# EAGLE design board (EAGLE 6.5.0)
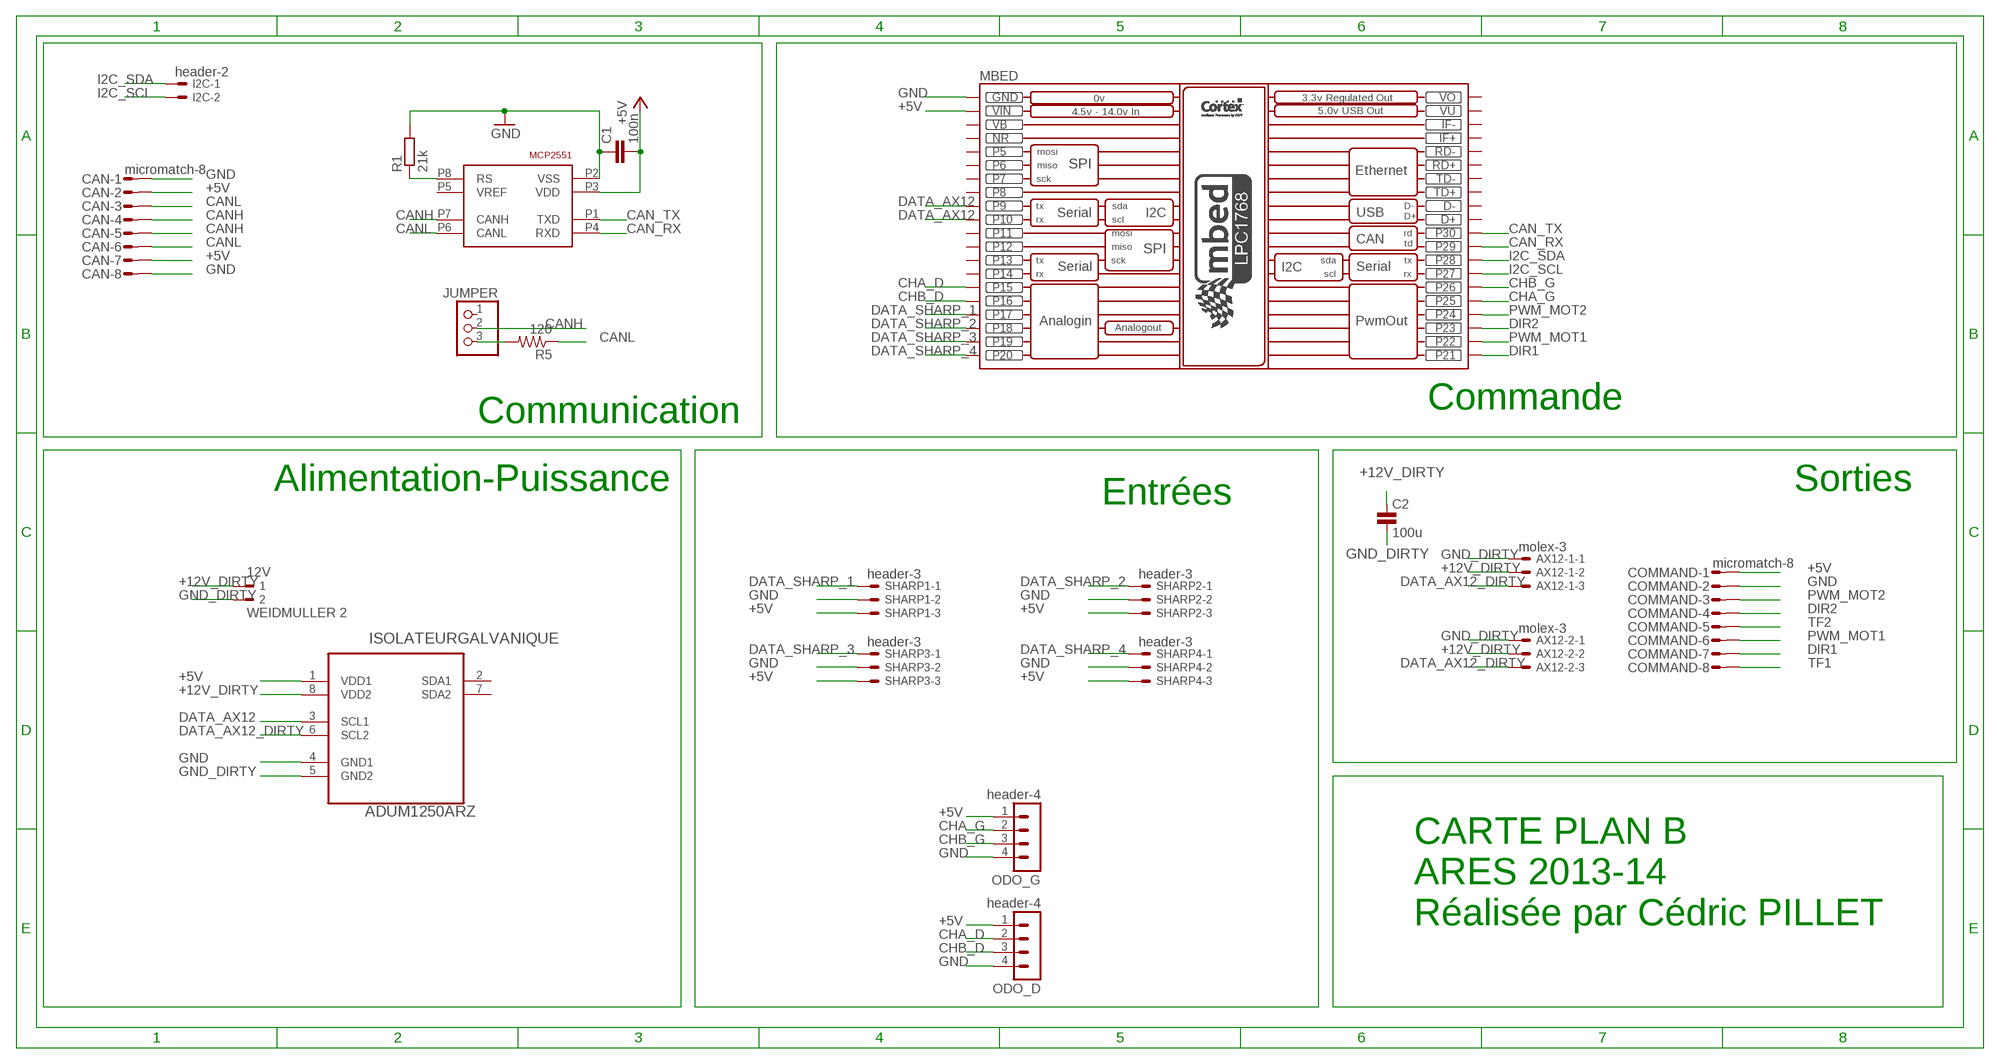
[diagram p0: schematic, sheet 1]

## Parts
12V  WEIDMULLER 2  90G-2  [90G-2]
AX12-1  molex-3  22-23-2031  [22-23-2031]
AX12-2  molex-3  22-23-2031  [22-23-2031]
C1  100n  C-EUC0805  [C0805]
C2  100u  C0805  [0805]
CAN  micromatch-8  MICROMATCH-8  [MICROMATCH-8]
COMMAND  micromatch-8  MICROMATCH-8  [MICROMATCH-8]
I2C  header-2  22-23-2021  [22-23-2021]
ISOLATEURGALVANIQUE  ADUM1250ARZ  [SOIC127P600X175-8N]
JUMPER  PINHD-1X3  [1X03]
MBED  MBED_NXP_LPC1768  [MBED-KIT]
ODO_D  header-4  MA04-1  [MA04-1]
ODO_G  header-4  MA04-1  [MA04-1]
R1  21k  R-EU_R0805  [R0805]
R5  120  R-US_M0805  [M0805]
SHARP1  header-3  22-23-2031  [22-23-2031]
SHARP2  header-3  22-23-2031  [22-23-2031]
SHARP3  header-3  22-23-2031  [22-23-2031]
SHARP4  header-3  22-23-2031  [22-23-2031]
TRANSCEIVER  MCP2551  [SOIC_8]

## Nets
+5V: C1.2 CAN.2 CAN.7 COMMAND.1 ISOLATEURGALVANIQUE.1(VDD1) MBED.VIN ODO_D.1 ODO_G.1 SHARP1.3 SHARP2.3 SHARP3.3 SHARP4.3 TRANSCEIVER.P3(VDD)
+12V_DIRTY: 12V.1 AX12-1.2 AX12-2.2 C2.1 ISOLATEURGALVANIQUE.8(VDD2)
CAN_RX: MBED.P$29(P29) TRANSCEIVER.P4(RXD)
CAN_TX: MBED.P$30(P30) TRANSCEIVER.P1(TXD)
CANH: CAN.4 CAN.5 JUMPER.2 TRANSCEIVER.P7(CANH)
CANL: CAN.3 CAN.6 R5.1 TRANSCEIVER.P6(CANL)
CHA_D: MBED.P$15(P15) ODO_D.2
CHA_G: MBED.P$25(P25) ODO_G.2
CHB_D: MBED.P$16(P16) ODO_D.3
CHB_G: MBED.P$26(P26) ODO_G.3
DATA_AX12: ISOLATEURGALVANIQUE.3(SCL1) MBED.P$9(P9) MBED.P$10(P10)
DATA_AX12_DIRTY: AX12-1.3 AX12-2.3 ISOLATEURGALVANIQUE.6(SCL2)
DATA_SHARP_1: MBED.P$17(P17) SHARP1.1
DATA_SHARP_2: MBED.P$18(P18) SHARP2.1
DATA_SHARP_3: MBED.P$19(P19) SHARP3.1
DATA_SHARP_4: MBED.P$20(P20) SHARP4.1
DIR1: COMMAND.7 MBED.P$21(P21)
DIR2: COMMAND.4 MBED.P$23(P23)
GND: C1.1 CAN.1 CAN.8 COMMAND.2 ISOLATEURGALVANIQUE.4(GND1) MBED.GND ODO_D.4 ODO_G.4 R1.2 SHARP1.2 SHARP2.2 SHARP3.2 SHARP4.2 TRANSCEIVER.P2(VSS)
GND_DIRTY: 12V.2 AX12-1.1 AX12-2.1 C2.2 ISOLATEURGALVANIQUE.5(GND2)
I2C_SCL: I2C.2 MBED.P$27(P27)
I2C_SDA: I2C.1 MBED.P$28(P28)
N$1: R1.1 TRANSCEIVER.P8(RS)
N$9: JUMPER.3 R5.2
PWM_MOT1: COMMAND.6 MBED.P$22(P22)
PWM_MOT2: COMMAND.3 MBED.P$24(P24)
TF1: COMMAND.8
TF2: COMMAND.5
Unconnected: ISOLATEURGALVANIQUE.2(SDA1) ISOLATEURGALVANIQUE.7(SDA2) JUMPER.1 MBED.D+ MBED.D- MBED.IF+ MBED.IF- MBED.P$5(P5) MBED.P$6(P6) MBED.P$7(P7) MBED.P$8(P8) MBED.P$11(P11) MBED.P$12(P12) MBED.P$13(P13) MBED.P$14(P14) MBED.RD+ MBED.RD- MBED.TD+ MBED.TD- TRANSCEIVER.P5(VREF)

## Notes on the sheet
- Commande
- Communication
- Alimentation-Puissance | Sorties
- Entrées
- CARTE PLAN B
  ARES 2013-14
  Réalisée par Cédric PILLET

## Power pins joined to a net without a drawn wire
NR: MBED.NR
VB: MBED.VB
VO: MBED.VOUT(VO)
VU: MBED.VU

## Library data of the parts
12V = con-weidmueller-sl35:90G-2: WEIDMUELLER CLAMP CONNECTOR; OC_FARNELL: unknown; OC_NEWARK: unknown
AX12-1 AX12-2 SHARP1-SHARP4 = con-molex:22-23-2031: .100" (2.54mm) Center Header - 3 Pin; MF: MOLEX; MPN: 22-23-2031; OC_FARNELL: 1462950; OC_NEWARK: 30C0862
C1 = rcl:C-EU: CAPACITOR, European symbol
C2 = mbed-rlcq:C
CAN COMMAND = con-amp-micromatch:MICROMATCH-8: MicroMaTch 8 7-215464-8 / 0-215464-8 Drawing Number C-215464 DDEController.pdf; MF: FARNELL; MPN: 7-215464-8; OC_FARNELL: 3784642; OC_NEWARK: 26H0301
I2C = con-molex:22-23-2021: .100" (2.54mm) Center Header - 2 Pin; MF: MOLEX; MPN: 22-23-2021; OC_FARNELL: 1462926; OC_NEWARK: 25C3832
ISOLATEURGALVANIQUE = Analog Devices_By_element14_Batch_1:ADUM1250ARZ: Hot Swappable, Dual I2C Isolators; MPN: ADUM1250ARZ; OC_FARNELL: 1814353; OC_NEWARK: 27M9880; PACKAGE: SOIC-8; SUPPLIER: Analog Devices
JUMPER = pinhead:PINHD-1X3: PIN HEADER
MBED = MBED_v2.1:MBED_NXP_LPC1768: Mbed LPC1768 - ARM CORTEX v2.1 * Schematic symbol is now placed in eagles's default raster. *The pads diameter are suitable for routing between mbed pins * mbed pads are 0.8 mm drill diameter. --------------------------------------------- Created by: Mohamed Yousry *Alexandria, Egypt *Email: mohamed.yousry@ieeegoldegypt.org
ODO_D ODO_G = con-lstb:MA04-1: PIN HEADER; OC_FARNELL: unknown; OC_NEWARK: unknown
R1 = rcl:R-EU_: RESISTOR, European symbol
R5 = rcl:R-US_: RESISTOR, American symbol
TRANSCEIVER = microchip:MCP2551

## Board
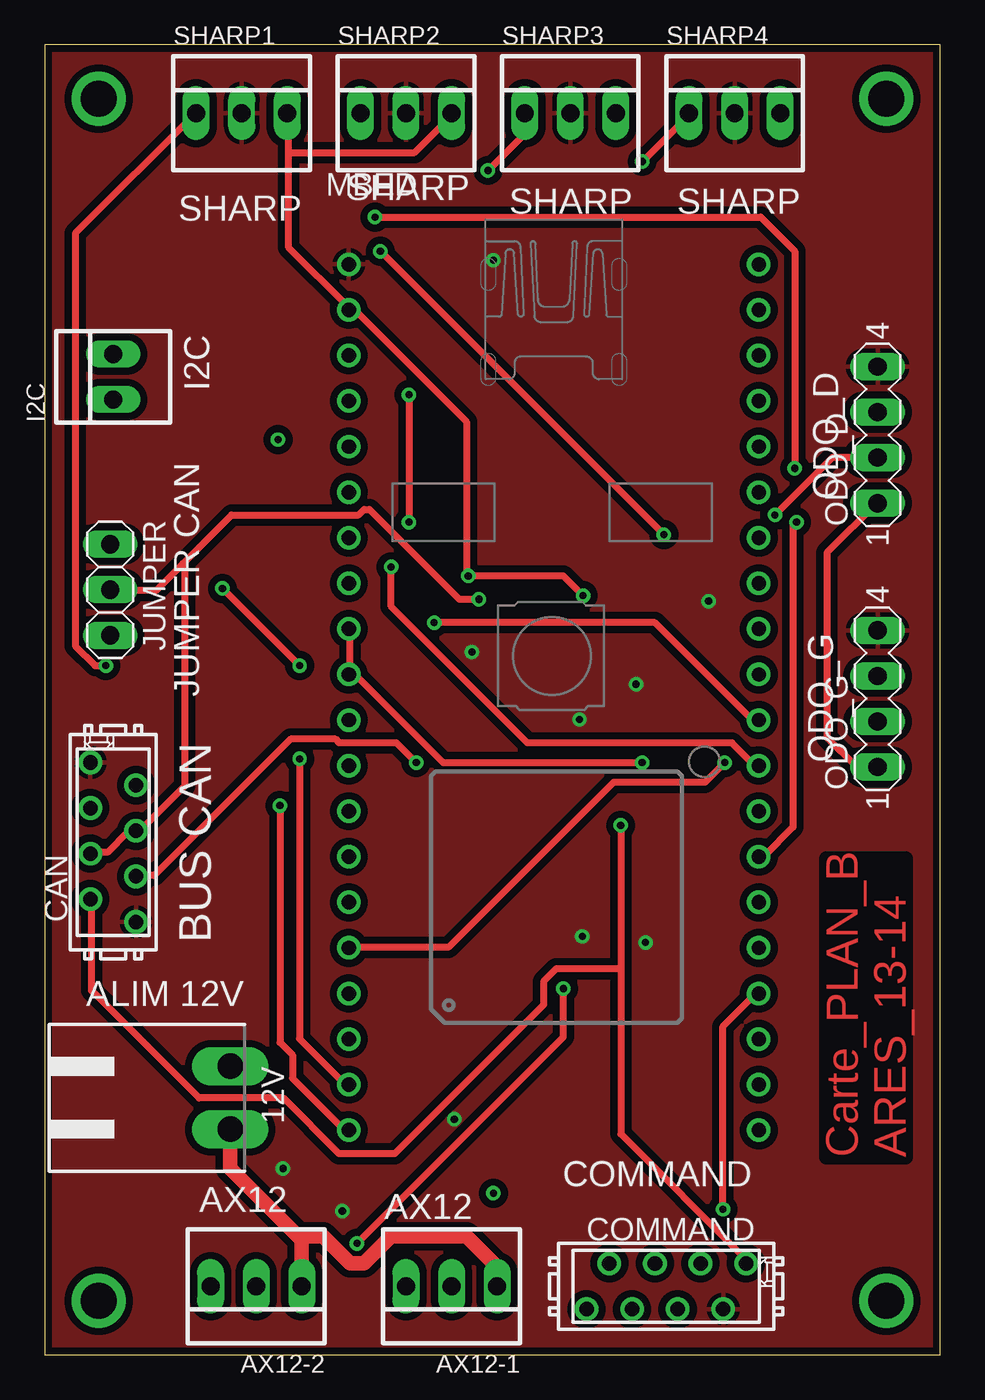
[diagram p1: board, top side]
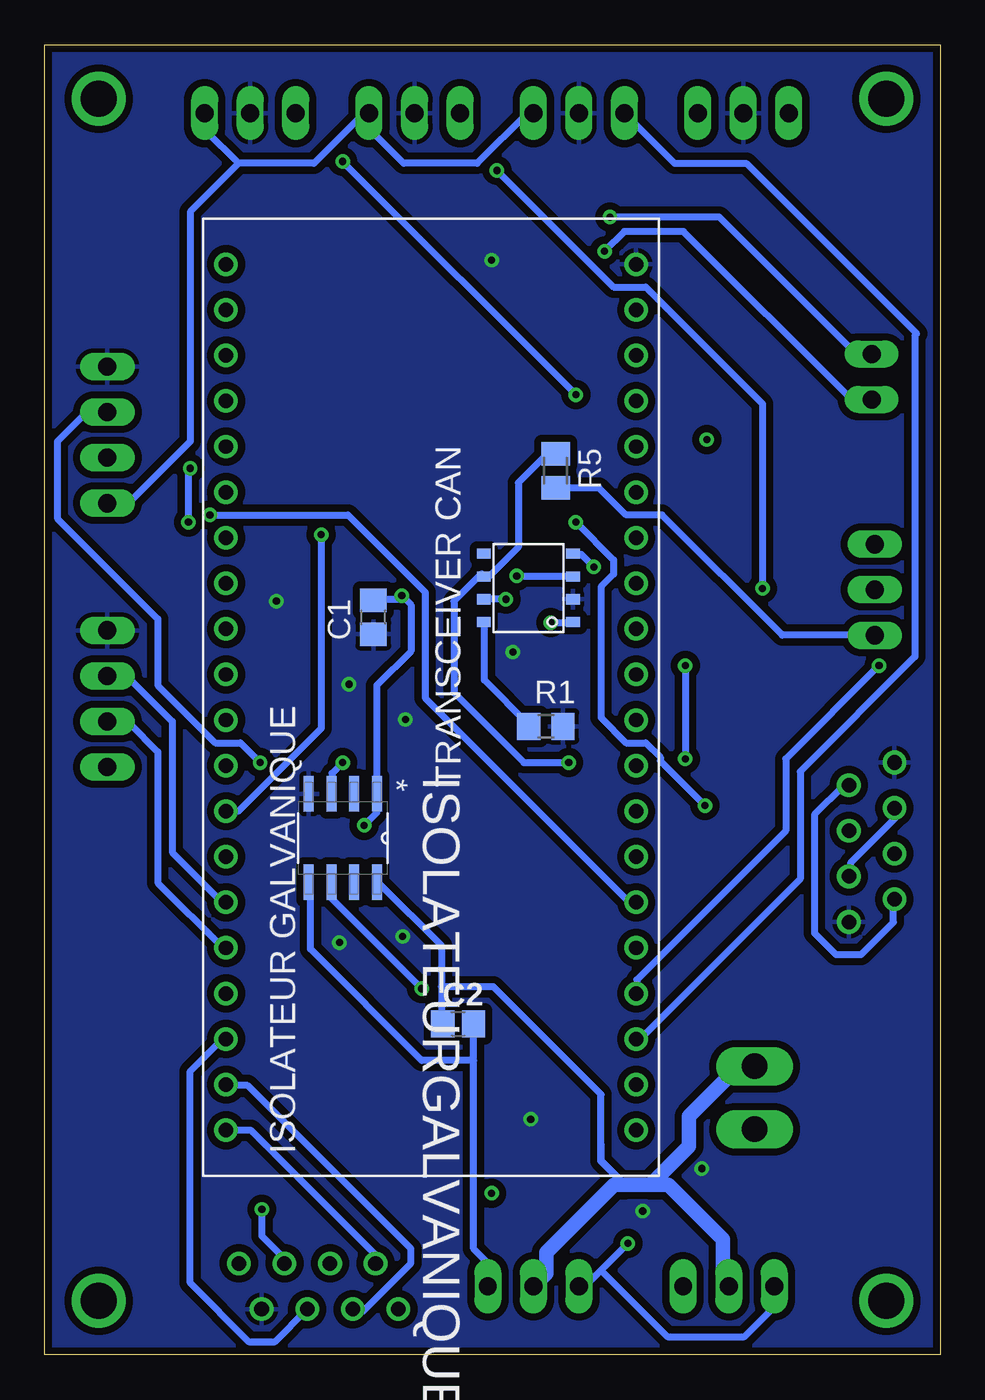
[diagram p2: board, bottom side, seen from below]

Size 49.9 x 73 mm. Coordinates in mm from the lower left corner, seen from the top.
Outline: 0,0 49.9,0 49.9,73 0,73 0,0
Copper layers (1*16): Top 0.035mm / dielectric 1.5mm / Bottom 0.035mm
Design rules "default *": minimum track width 0.4mm, minimum drill 0.4mm, track to track 0.4mm, track to pad 0.4mm, pad to pad 0.4mm, via to via 0.4mm, smd to smd 8mil, copper to edge 0.4mm, drill to drill 8mil, minimum pad ring 10mil, minimum via ring 8mil, stop-mask expansion 4mil, vias tented up to drill 0mil, thermal gap 10mil

### Footprints (pad centres in the part's own frame; a part is rotated, then mirrored left to right if it is on the bottom)
90G-2 = drill 1.422 long: 1 -1.75,5.25; 2 1.75,5.25
22-23-2031 = drill 1 long: 1 -2.54,0; 2 0,0; 3 2.54,0
C0805 = smd 1.3 x 1.5: 1 -0.95,0; 2 0.95,0
0805 = smd 1.3 x 1.5: 1 -0.85,0; 2 0.85,0
MICROMATCH-8 = drill 0.813: 1 4.445,1.27; 2 3.175,-1.27; 3 1.905,1.27; 4 0.635,-1.27; 5 -0.635,1.27; 6 -1.905,-1.27; 7 -3.175,1.27; 8 -4.445,-1.27
22-23-2021 = drill 1 long: 1 -1.27,0; 2 1.27,0
SOIC127P600X175-8N = smd 1.981 x 0.559: 1 -2.464,1.905; 2 -2.464,0.635; 3 -2.464,-0.635; 4 -2.464,-1.905; 5 2.464,-1.905; 6 2.464,-0.635; 7 2.464,0.635; 8 2.464,1.905
1X03 = drill 1.016 long: 1 -2.54,0; 2 0,0; 3 2.54,0
MBED-KIT = drill 0.8: D+ 11.43,1.27; D- 11.43,3.81; GND -11.43,24.13; IF+ 11.43,16.51; IF- 11.43,19.05; NR -11.43,16.51; P$5 -11.43,13.97; P$6 -11.43,11.43; P$7 -11.43,8.89; P$8 -11.43,6.35; P$9 -11.43,3.81; P$10 -11.43,1.27; P$11 -11.43,-1.27; P$12 -11.43,-3.81; P$13 -11.43,-6.35; P$14 -11.43,-8.89; P$15 -11.43,-11.43; P$16 -11.43,-13.97; P$17 -11.43,-16.51; P$18 -11.43,-19.05; P$19 -11.43,-21.59; P$20 -11.43,-24.13; P$21 11.43,-24.13; P$22 11.43,-21.59; P$23 11.43,-19.05; P$24 11.43,-16.51; P$25 11.43,-13.97; P$26 11.43,-11.43; P$27 11.43,-8.89; P$28 11.43,-6.35; P$29 11.43,-3.81; P$30 11.43,-1.27; RD+ 11.43,11.43; RD- 11.43,13.97; TD+ 11.43,6.35; TD- 11.43,8.89; VB -11.43,19.05; VIN -11.43,21.59; VOUT 11.43,24.13; VU 11.43,21.59
MA04-1 = drill 1.016 long: 1 -3.81,0; 2 -1.27,0; 3 1.27,0; 4 3.81,0
R0805 = smd 1.3 x 1.5: 1 -0.95,0; 2 0.95,0
M0805 = smd 1.3 x 1.6: 1 -0.95,0; 2 0.95,0
SOIC_8 = smd 0.559 x 0.762: P1 0,-4.966; P2 1.27,-4.966; P3 2.54,-4.966; P4 3.81,-4.966; P5 3.81,0; P6 2.54,0; P7 1.27,0; P8 0,0

### Placement (x,y rotation side)
12V  5.08,14.32 270 top
AX12-1  22.67,3.81 180 top
AX12-2  11.78,3.81 180 top
C1  31.59,41.1 90 bottom
C2  26.86,18.43 0 bottom
CAN  3.81,28.56 90 top
COMMAND  34.64,3.81 0 top
I2C  3.81,54.5 90 top
ISOLATEURGALVANIQUE  33.29,28.79 270 bottom
JUMPER  3.64,42.63 270 top
MBED  28.37,36.64 0 top
ODO_D  46.42,51.26 90 top
ODO_G  46.42,36.56 90 top
R1  21.97,35.02 0 bottom
R5  21.43,49.26 270 bottom
SHARP1  10.97,69.2 0 top
SHARP2  20.13,69.2 0 top
SHARP3  29.29,69.2 0 top
SHARP4  38.45,69.2 0 top
TRANSCEIVER  25.43,40.83 90 bottom

### Tracks (layer width: path | path; a pad name or v marks a point on that pad's centre or on a via)
+5V  (via drill 0.4)
  Top 0.4: v30,42.3 28.9,43.4 v23.6,43.4 23.5,43.5 23.5,52 17.4,58.1 17.1,58.1 MBED.VIN 16.9,58.4 13.6,61.7 13.6,67 | v32.1,29.5 32.1,21.5 | 32.1,21.5 32.1,12.3 39,5.4 39,5.1 COMMAND.1 | ODO_G.1 46.4,32.8 45.2,32.8 43.6,34.4 43.6,44.7 46.4,47.5 ODO_D.1 | 13.6,67 13.6,69.2 SHARP1.3 | 32.1,21.5 28.5,21.5 27.8,20.8 27.8,19.5 19.5,11.2 16.4,11.2 13.3,14.3 8.6,14.3 2.6,20.3 2.6,25.3 CAN.7 | 13.6,67 20.6,67 22.6,69 22.6,69.2 SHARP2.3
  Bottom 0.4: v23.6,43.4 20.5,43.4 TRANSCEIVER.P3 | C1.2 31.5,42.1 30.2,42.1 v30,42.3 29.5,41.8 29.5,39.2 31.4,37.3 31.4,31.3 ISOLATEURGALVANIQUE.1 31.4,31.1 31.4,30.2 v32.1,29.5 | CAN.7 2.6,25.3 2.6,24.1 4.4,22.3 5.8,22.3 7,23.5 7,30.1 5.4,31.7 5.1,31.7 CAN.2 | SHARP2.3 23,69.2 25.8,66.4 29.9,66.4 31.8,68.3 31.8,69.2 SHARP3.3 32,69.3 34.9,66.4 39.1,66.4 | 39.1,66.4 40.9,68.2 40.9,69.2 SHARP4.3 | 39.1,66.4 41.8,63.7 41.8,50.9 45.2,47.5 46.4,47.5 ODO_D.1
+12V_DIRTY
  Bottom 0.4: 27.8,20.5 27.8,22.8 31.3,26.3 ISOLATEURGALVANIQUE.8 | 27.8,20.5 27.8,18.5 C2.1 | 11.8,3.9 AX12-2.2 | 10.4,16 12V.1 | 22.6,5 22.6,3.9 AX12-1.2 | 27.8,20.5 24.9,20.5 18.9,14.5 18.9,11.7
  Bottom 0.406: 18.9,11.7 18.9,10.79 17.57,9.46
  Bottom 0.813: 10.4,16 11.27,16 13.99,13.28 13.99,11.62 16.15,9.46 | 16.15,9.46 17.57,9.46 18.19,9.46 21.95,5.7 21.95,4.53 AX12-1.2 | 16.15,9.46 15.15,9.46 12.11,6.42 12.11,4.14 AX12-2.2
CAN_RX  (via drill 0.4)
  Top 0.4: v19.3,43.9 19.3,41.7 26.9,34.1 38.3,34.1 39.5,32.9 39.8,32.9 MBED.P$29
  Bottom 0.4: v19.3,43.9 20,44.6 20.4,44.6 TRANSCEIVER.P4
CAN_TX  (via drill 0.4)
  Top 0.4: v21.7,40.8 34,40.8 39.4,35.4 39.8,35.4 MBED.P$30
  Bottom 0.4: v21.7,40.8 20.5,40.8 TRANSCEIVER.P1
CANH  (via drill 0.4)
  Top 0.4: CAN.5 2.6,28 3.5,28 4.6,29.1 5,29.1 CAN.4 5.2,29.3 5.4,29.3 7.8,31.7 7.8,44 7.7,44.1 | v24.2,42.1 23.1,42.1 18.1,47.1 17.8,47.1 17.5,46.8 10.4,46.8 7.7,44.1 | 7.7,44.1 6.2,42.6 3.7,42.6 JUMPER.2
  Bottom 0.4: v24.2,42.1 TRANSCEIVER.P7
CANL  (via drill 0.4)
  Top 0.4: v20.7,33 19.6,34.1 16.4,34.1 16.2,34.3 13.7,34.3 6.1,26.7 5.1,26.7 CAN.6
  Bottom 0.4: CAN.6 5,26.7 5,27.4 2.5,29.9 2.5,30.4 CAN.3 | R5.1 21.5,50.2 21.9,50.2 23.5,48.6 23.5,45 25.1,43.4 25.4,43.4 TRANSCEIVER.P6 25.5,43.5 25.6,43.5 27.1,42 27.1,36.9 23.2,33 v20.7,33
CHA_D  (via drill 0.4)
  Top 0.4: v40.7,46.8 43.9,50 46.4,50 ODO_D.2
  Bottom 0.4: v40.7,46.8 33,46.8 28.7,42.5 28.7,36.6 17.4,25.3 17,25.3 MBED.P$15
CHA_G
  Bottom 0.4: MBED.P$25 39.8,22.7 40,22.7 43.6,26.3 43.6,33.6 45.2,35.2 46.4,35.2 ODO_G.2
CHB_D  (via drill 0.4)
  Top 0.4: v37.9,33 36.8,31.9 31.7,31.9 22.5,22.7 17,22.7 MBED.P$16
  Bottom 0.4: v37.9,33 39,34.1 40.4,34.1 43.6,37.3 43.6,41 49.2,46.6 49.2,50.9 47.6,52.5 46.5,52.5 ODO_D.3
CHB_G
  Bottom 0.4: MBED.P$26 39.8,25.3 40.1,25.3 42.8,28 42.8,35.3 45.3,37.8 46.4,37.8 ODO_G.3
DATA_AX12  (via drill 0.4)
  Top 0.4: v33.3,33 22.2,33 17.3,37.9 17,37.9 MBED.P$10 17,38.1 17,40.4 MBED.P$9
  Bottom 0.4: v33.3,33 33.9,32.4 33.9,31.3 ISOLATEURGALVANIQUE.3
DATA_AX12_DIRTY  (via drill 0.4)
  Top 0.4: v28.9,20.4 28.9,17.7 v17.4,6.2
  Bottom 0.4: v28.9,20.4 33.9,25.4 33.9,26.3 ISOLATEURGALVANIQUE.6 | 18.9,4.7 19.7,3.9 20.1,3.9 AX12-1.3 | 18.9,4.7 v17.4,6.2 | 18.9,4.7 15.2,1 10.9,1 9.3,2.6 9.3,3.8 AX12-2.3
DATA_SHARP_1  (via drill 0.4)
  Top 0.4: v3.4,38.4 2.8,38.4 1.7,39.5 1.7,62.5 8.4,69.2 SHARP1.1
  Bottom 0.4: v3.4,38.4 8.6,33.2 8.6,29.2 16.9,20.9 16.9,20.2 MBED.P$17
DATA_SHARP_2
  Bottom 0.4: MBED.P$18 16.9,17.6 16.7,17.6 7.8,26.5 7.8,32.5 1.4,38.9 1.4,56.8 1.3,56.9 10.8,66.4 14.8,66.4 SHARP2.1
DATA_SHARP_3  (via drill 0.4)
  Top 0.4: v14.2,33.2 14.2,17.6 16.7,15.1 16.9,15.1 MBED.P$19 | v9.9,42.7 v14.2,38.4 | v24.7,66 26.7,68 26.7,69.2 SHARP3.1
  Bottom 0.4: v14.2,38.4 v14.2,33.2 | v9.9,42.7 9.9,53 16.4,59.5 18.2,59.5 v24.7,66
DATA_SHARP_4  (via drill 0.4)
  Top 0.4: v13.1,30.6 13.1,17.4 13.8,16.7 13.8,15.4 16.6,12.6 16.9,12.6 MBED.P$20 | v20.3,53.5 v20.3,46.4 | v33.3,66.5 36,69.2 SHARP4.1
  Bottom 0.4: v13.1,30.6 15.6,33.1 15.6,33.3 16.4,34.1 17.5,34.1 18.9,35.5 18.9,42.8 18.2,43.5 18.2,44.3 v20.3,46.4 | v33.3,66.5 v20.3,53.5
DIR1
  Bottom 0.4: MBED.P$21 38.4,12.5 31.5,5.6 31.5,5.1 COMMAND.7
DIR2
  Bottom 0.4: MBED.P$23 39.8,17.5 40.1,17.5 41.8,15.8 41.8,4 38.5,0.7 37.1,0.7 35.3,2.5 COMMAND.4
GND  (via drill 0.4)
  Bottom 0.4: TRANSCEIVER.P2 20.5,42.1 20.45,42.11
  other vias: 25,61 37,42 33.48,22.97 29.96,23.31 23.81,39.16 29.8,35.4 32.95,37.36 13.28,10.37 16.58,8 22.82,13.12
  pour Bottom: 0,73 50,73 50,0 0,0
  pour Top: 0,73 50,73 50,0 0,0
GND_DIRTY
  Top 0.4: 14.24,6.48 14.3,6.6 | 14.3,3.9 AX12-2.1 | 25.2,4.9 25.2,3.9 AX12-1.1
  Top 0.8: 14.3,3.9 14.3,6.6 15.5,6.6 17,5.1 17.8,5.1 19.3,6.6 23.5,6.6 25.2,4.9 | 10.34,10.38 14.24,6.48
  Top 0.813: 10.34,10.38 12V.2
  Bottom 0.4: 26,16.4 26,5.9 25.3,5.2 25.3,3.9 AX12-1.1 | 26,16.4 26,18.4 C2.2 | 26,16.4 28.9,16.4 35.1,22.6 35.1,26.3 ISOLATEURGALVANIQUE.5
I2C_SCL  (via drill 0.4)
  Top 0.4: v41.9,46.4 41.7,46.2 41.7,29.4 40.1,27.8 39.8,27.8 MBED.P$27 | v41.8,49.4 41.8,61.5 39.9,63.4 v18.4,63.4
  Bottom 0.4: v41.9,46.4 41.9,49.3 v41.8,49.4 | v18.4,63.4 12.3,63.4 4.7,55.8 3.9,55.8 I2C.2
I2C_SDA  (via drill 0.4)
  Top 0.4: v18.7,61.5 v34.5,45.7
  Bottom 0.4: v34.5,45.7 34.5,34.9 39.1,30.3 MBED.P$28 | v18.7,61.5 17.6,62.6 14.3,62.6 5,53.3 3.9,53.3 I2C.1
N$1
  Bottom 0.4: TRANSCEIVER.P8 25.4,40.8 25.4,37.6 22.9,35.1 R1.1
N$2  (via drill 2)
  other vias: 46.9,70
N$3  (via drill 2)
  other vias: 3,70
N$4  (via drill 2)
  other vias: 46.9,3
N$5  (via drill 2)
  other vias: 3,3
N$9
  Bottom 0.4: R5.2 21.4,48.3 19,48.3 17.5,46.8 15.5,46.8 8.8,40.1 3.7,40.1 JUMPER.3
N$10  (via drill 0.4)
  other vias: 13,51
N$12  (via drill 0.4)
  other vias: 25,9
PWM_MOT1
  Bottom 0.4: MBED.P$22 39.8,15 38.6,15 29.5,5.9 29.5,5.1 32.2,2.4 32.6,2.4 32.7,2.5 COMMAND.6
PWM_MOT2  (via drill 0.4)
  Top 0.4: v37.8,8.1 37.8,18.3 39.6,20.1 39.8,20.1 MBED.P$24
  Bottom 0.4: v37.8,8.1 37.8,6.6 36.6,5.4 36.6,5.1 COMMAND.3

### Text on the board
Top: Carte_PLAN_B / ARES_13-14
tPlace: SHARP | SHARP | SHARP | SHARP | ODO_D | I2C | ODO_G | JUMPER CAN | BUS CAN | ALIM 12V | COMMAND | AX12 | AX12
bPlace: TRANSCEIVER CAN | ISOLATEUR GALVANIQUE